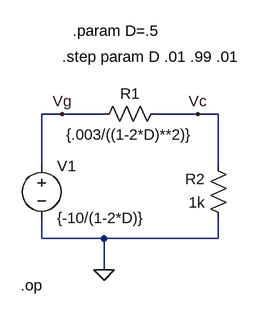
[diagram p0: schematic HBridgeDraft3.asc]
HBridgeDraft3.asc, the LTspice schematic file:
Version 4
SHEET 1 880 680
WIRE 112 96 80 96
WIRE 176 96 112 96
WIRE 320 96 256 96
WIRE 352 96 320 96
WIRE 80 176 80 96
WIRE 352 176 352 96
WIRE 80 288 80 256
WIRE 176 288 80 288
WIRE 352 288 352 256
WIRE 352 288 176 288
WIRE 176 336 176 288
FLAG 176 336 0
FLAG 320 96 Vc
FLAG 112 96 Vg
SYMBOL voltage 80 160 R0
WINDOW 123 0 0 Left 0
WINDOW 39 0 0 Left 0
SYMATTR InstName V1
SYMATTR Value {-10/(1-2*D)}
SYMBOL res 272 80 R90
WINDOW 0 0 56 VBottom 2
WINDOW 3 32 56 VTop 2
SYMATTR InstName R1
SYMATTR Value {.003/((1-2*D)**2)}
SYMBOL res 368 272 R180
WINDOW 0 36 76 Left 2
WINDOW 3 36 40 Left 2
SYMATTR InstName R2
SYMATTR Value 1k
TEXT 128 -32 Left 2 !.param D=.5
TEXT 112 8 Left 2 !.step param D .01 .99 .01
TEXT 48 360 Left 2 !.op

The netlist it stands for:
* HBridgeDraft3.asc
V1 Vg 0 {-10/(1-2*D)}
R1 Vc Vg {.003/((1-2*D)**2)}
R2 0 Vc 1k
.param D=.5
.step param D .01 .99 .01
.op
.backanno
.end